# Altium schematic sheet dev_board_top.SchDoc
size 209 x 297 mm; Author: ALTIUM GOSTBOM2.0 KEV; SheetNumber: 1; SheetTotal: 3
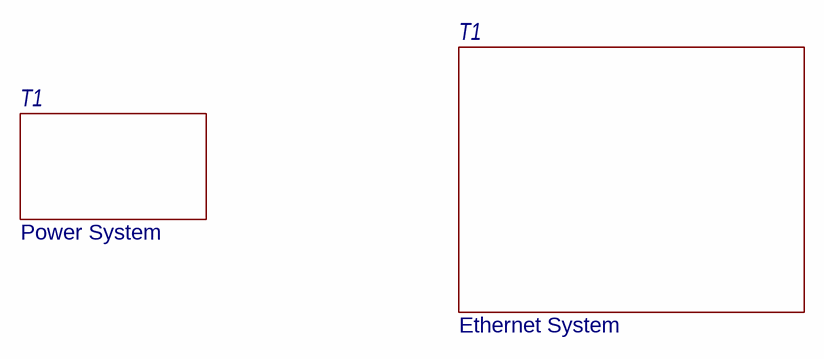
[diagram p0: dev_board_top.SchDoc]

## Sub-sheets
T1 = ethernet.SchDoc: no entries  | NameFunctionGroup: Ethernet System
T1 = power.SchDoc: no entries  | NameFunctionGroup: Power System

## Notes on the sheet
- Перв. примен.
- Справ. №
- Подп. дата
- Инв. № дубл.
- Взам. инв. №
- Подп. и дата
- Изм.
- Разраб.
- Лист
- № докум.
- Подп.
- Дата
- Лит.
- Масса
- Масштаб
- Пров.
- Т.контр.
- Листов
- Инв. № подл.
- Н.контр.
- Утв.
- Файл:
- ALTIUM GOSTBOM2.0 KEV
- Копировал
- Формат А4